# Altium schematic sheet Schematic Block.SchDoc
size A; SheetNumber: 1; SheetTotal: 2
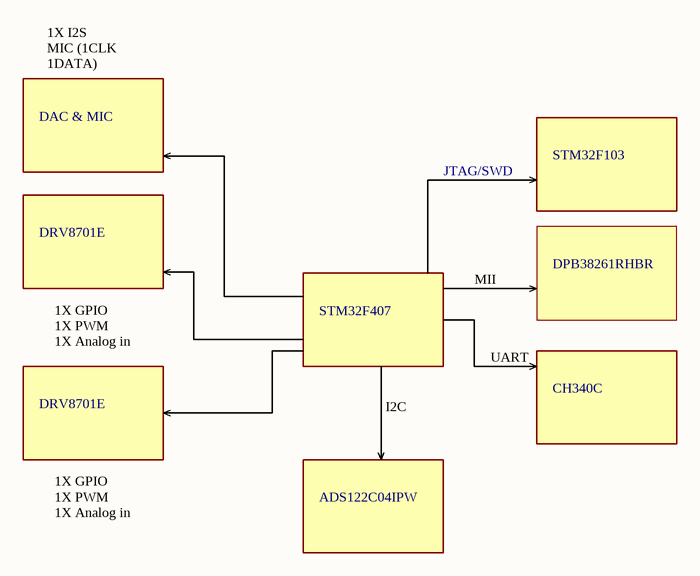
[diagram p0: Schematic Block.SchDoc]

## Notes on the sheet
- 1X I2S
  MIC (1CLK 1DATA)
- DAC & MIC
- STM32F103
- DRV8701E
- JTAG/SWD
- STM32F407
- MII
- DPB38261RHBR
- 1X GPIO
  1X PWM
  1X Analog in
- UART
- CH340C
- I2C
- ADS122C04IPW